# Altium schematic sheet Sheet1.SchDoc
size A4
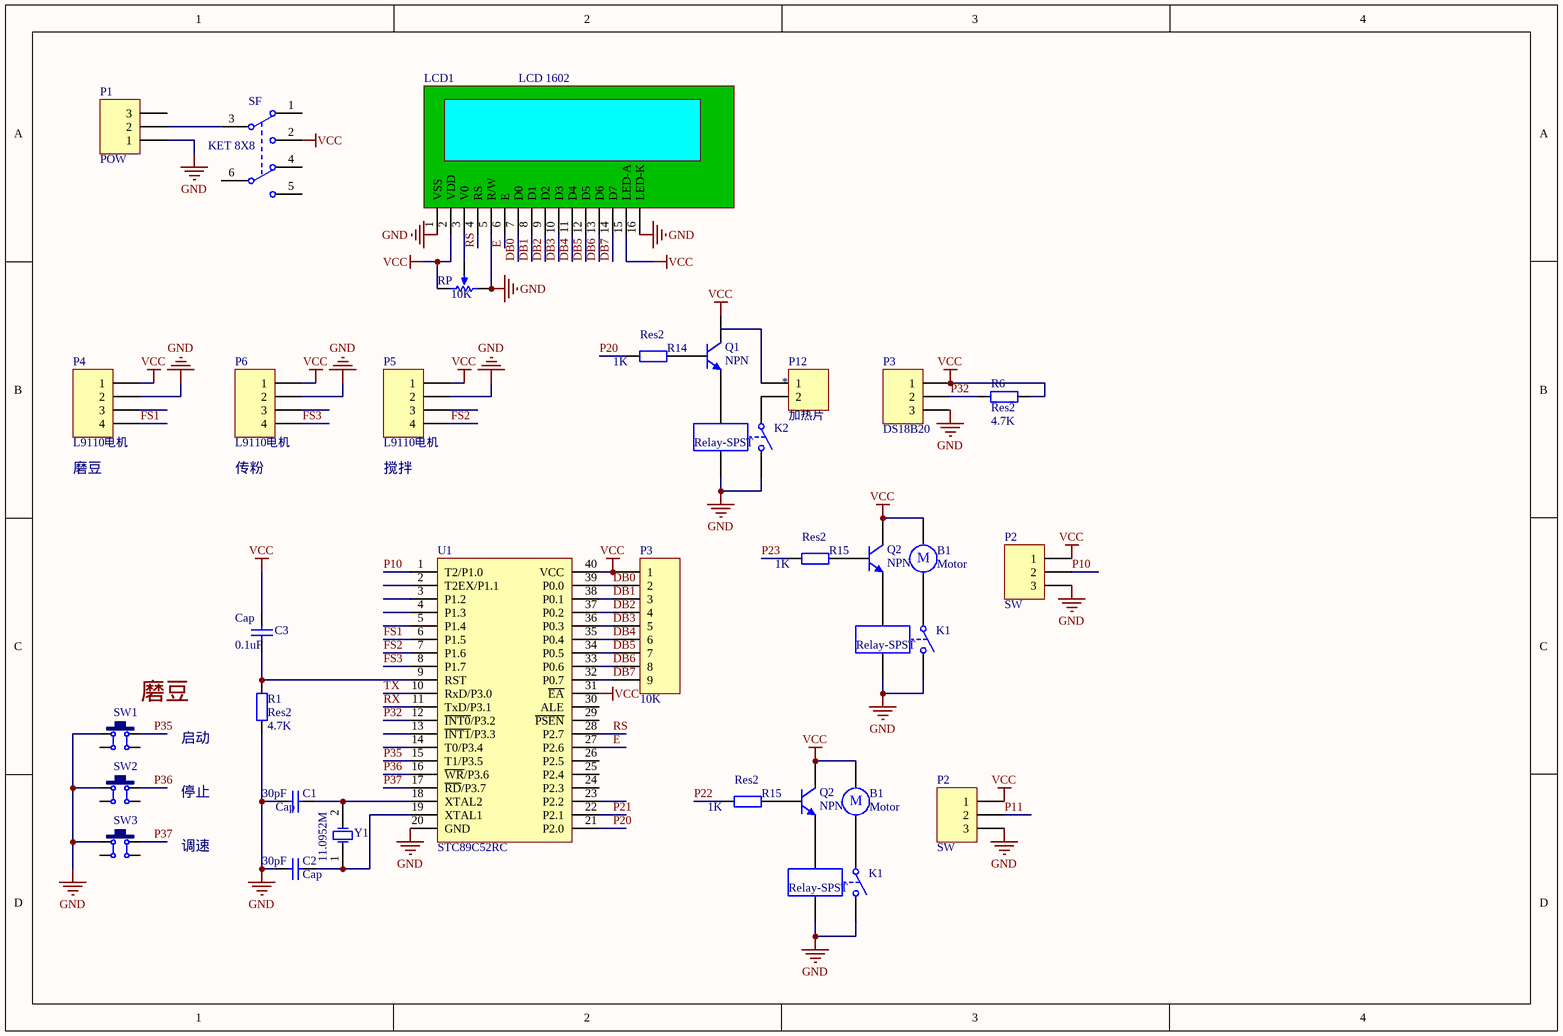
[diagram p0: Sheet1.SchDoc]

## Parts
(Parts that share a designator on the sheet are numbered #1, #2 ... from top to bottom, then left to right.)
B1#1  Motor  [RB5-10.5]
B1#2  Motor  [RB5-10.5]
C1  Cap  value 30pF  [BAT-2]
C2  Cap  value 30pF  [BAT-2]
C3  Cap  value 0.1uF  [RAD-0.1]
K1#1  Relay-SPST  [MODULE4]
K1#2  Relay-SPST  [MODULE4]
K2  Relay-SPST  [MODULE4]
LCD1  LCD 1602  [LCD-1602]
P1  POW  [POW]
P2#1  SW  [DS18B20]
P2#2  SW  [DS18B20]
P3#1  DS18B20  [DS18B20]
P3#2  10K  [HDR1X9]
P4  L9110电机  [HDR1X4]
P5  L9110电机  [HDR1X4]
P6  L9110电机  [HDR1X4]
P12  *  C: 加热片  [HDR1X2]
Q1  NPN  [TO-226-AA]
Q2#1  NPN  [TO-226-AA]
Q2#2  NPN  [TO-226-AA]
R1  Res2  value 4.7K  [AXIAL-0.4]
R6  Res2  value 4.7K  [AXIAL-0.4]
R14  Res2  value 1K  [AXIAL-0.4]
R15#1  Res2  value 1K  [AXIAL-0.4]
R15#2  Res2  value 1K  [AXIAL-0.4]
RP  value 10K  [RP_10K]
SF  KET 8X8  [KFT DIP-8X8]
SW1  6x6x5  [KEY_6*6*6]  (value not drawn)
SW2  6x6x5  [KEY_6*6*6]  (value not drawn)
SW3  6x6x5  [KEY_6*6*6]  (value not drawn)
U1  STC89C52RC  [DIP40-600]
Y1  11.0952M  [AXIAL-0.2]

## Nets
GND: C1.2 C2.1 K1#1.2 K1#1.4 K1#2.2 K1#2.4 K2.2 K2.4 LCD1.1(VSS) LCD1.5(R/W) LCD1.16(LED-K) P1.1 P2#1.3 P2#2.3 P3#1.3 P4.2 P5.2 P6.2 R1.1 RP.1(TOP) SW1.1 SW2.1 SW3.1 U1.20(GND)
VCC: B1#1.1 B1#2.1 C3.1 LCD1.2(VDD) LCD1.15(LED-A) P2#1.1 P2#2.1 P3#1.1 P3#2.1 P4.1 P5.1 P6.1 Q1.1(C) Q2#1.1(C) Q2#2.1(C) R6.2 RP.2(BOT) SF.2(COM2) U1.31(~{EA}) U1.40(VCC)
DB0: LCD1.7(D0) P3#2.2 U1.39(P0.0)
DB1: LCD1.8(D1) P3#2.3 U1.38(P0.1)
DB2: LCD1.9(D2) P3#2.4 U1.37(P0.2)
DB3: LCD1.10(D3) P3#2.5 U1.36(P0.3)
DB4: LCD1.11(D4) P3#2.6 U1.35(P0.4)
DB5: LCD1.12(D5) P3#2.7 U1.34(P0.5)
DB6: LCD1.13(D6) P3#2.8 U1.33(P0.6)
DB7: LCD1.14(D7) P3#2.9 U1.32(P0.7)
E: LCD1.6(E) U1.27(P2.6)
FS1: P4.4 U1.6(P1.5)
FS2: P5.4 U1.7(P1.6)
FS3: P6.4 U1.8(P1.7)
P10: P2#1.2 U1.1(T2/P1.0)
P11: P2#2.2
P20: R14.2 U1.21(P2.0)
P21: U1.22(P2.1)
P22: R15#2.2
P23: R15#1.2
P32: P3#1.2 R6.1 U1.12(~{INT0}/P3.2)
P35: SW1.2 U1.15(T1/P3.5)
P36: SW2.2 U1.16(~{WR}/P3.6)
P37: SW3.2 U1.17(~{RD}/P3.7)
RS: LCD1.4(RS) U1.28(P2.7)
RX: U1.11(TxD/P3.1)
TX: U1.10(RxD/P3.0)
NetB1#1_2: B1#1.2 K1#1.1
NetB1#2_2: B1#2.2 K1#2.1
NetC1_1: C1.1 U1.18(XTAL2) Y1.2(OSC2)
NetC2_2: C2.2 U1.19(XTAL1) Y1.1(OSC1)
NetC3_2: C3.2 R1.2 U1.9(RST)
NetK1#1_3: K1#1.3 Q2#1.3(E)
NetK1#2_3: K1#2.3 Q2#2.3(E)
NetK2_1: K2.1 P12.2
NetK2_3: K2.3 Q1.3(E)
NetLCD1_3: LCD1.3(V0) RP.3(TAP)
NetP1_2: P1.2 SF.3(NO1)
NetQ1_2: Q1.2(B) R14.1
NetQ2#1_2: Q2#1.2(B) R15#1.1
NetQ2#2_2: Q2#2.2(B) R15#2.1

Not connected (* = marked no-connect by the designer): P1 3; P4 3; P5 3; P6 3; P12 1; SF 1(NC1) 4(NO2) 5(COM2) 6(NC2); SW1 3 4; SW2 3 4; SW3 3 4; U1 2(T2EX/P1.1) 3(P1.2) 4(P1.3) 5(P1.4) 13(~{INT1}/P3.3) 14(T0/P3.4) 23(P2.2) 24(P2.3) 25(P2.4) 26(P2.5) 29(~{PSEN}) 30(ALE)

## Notes on the sheet
- (near P4) 磨豆
- (near P6) 传粉
- (near P5) 搅拌
- 启动
- 停止
- 调速
- Labels drawn without touching a wire or pin: 磨豆
- (in symbol Motor) M

## Library data of the parts
B1#1 B1#2 = Motor: Motor, General Kind; Published: 24-Mar-1999; LatestRevisionDate: 17-Jul-2002; LatestRevisionNote: Re-released for DXP Platform.; PackageReference: RB5-10.5; Publisher: Altium Limited; PackageDescription: Capacitor (Radial); 2 Leads
C1-C3 = Cap: Capacitor; Published: 8-Jun-2000; LatestRevisionDate: 17-Jul-2002; LatestRevisionNote: Re-released for DXP Platform.; PackageReference: RAD-0.3; Publisher: Altium Limited; PackageDescription: Radial Cap, Thru-Hole; 2 Leads; 0.3 in Pin Spacing
K1#1 K1#2 K2 = Relay-SPST: Single-Pole Single-Throw Relay; Published: 24-Mar-1999; LatestRevisionDate: 17-Jul-2002; LatestRevisionNote: Re-released for DXP Platform.; PackageReference: MODULE4; Publisher: Altium Limited
LCD1 = LC: BOM名?: LCD 1602; 学?: https://lmdzstyle.taobao.com/
P1 P2#1 P2#2 P3#1 = Header 3: Header, 3-Pin; LatestRevisionDate: 17-Jul-2002; LatestRevisionNote: Re-released for DXP Platform.; Publisher: Altium Limited
P3#2 = Header 9: Header, 9-Pin; LatestRevisionDate: 17-Jul-2002; LatestRevisionNote: Re-released for DXP Platform.; Publisher: Altium Limited
P4-P6 = Header 4: Header, 4-Pin; LatestRevisionDate: 17-Jul-2002; LatestRevisionNote: Re-released for DXP Platform.; Publisher: Altium Limited
P12 = Header 2: Header, 2-Pin; LatestRevisionDate: 17-Jul-2002; LatestRevisionNote: Re-released for DXP Platform.; Publisher: Altium Limited
Q1 Q2#1 Q2#2 = NPN: NPN Bipolar Transistor; Published: 8-Jun-2000; LatestRevisionDate: 17-Jul-2002; LatestRevisionNote: Re-released for DXP Platform.; PackageReference: TO-226-AA; Publisher: Altium Limited; PackageDescription: TO, Flat Index; 3 In-Line, Axial Leads; Body Dia. 4.8mm; Leads 0.55 x 0.51 mm (max); Code_JEDEC: TO-226-AA
R1 R6 R14 R15#1 R15#2 = Res2: Resistor; Published: 8-Jun-2000; LatestRevisionDate: 17-Jul-2002; LatestRevisionNote: Re-released for DXP Platform.; PackageReference: AXIAL-0.4; Publisher: Altium Limited; PackageDescription: Axial Device, Thru-Hole; 2 Leads; 0.4 in Pin Spacing
RP = RPot: Potentiometer; Sim Note: Enter the Resistance value and the set point into parameter fields.; Set Position: 0.5; Published: 8-Jun-2000; LatestRevisionDate: 17-Jul-2002; LatestRevisionNote: Re-released for DXP Platform.; PackageReference: VR5; Publisher: Altium Limited; PackageDescription: Variable Resistor, Thru-Hole; 3 Leads
SF = KET 8X8: 8*8自锁开关; 学?: https://lmdzstyle.taobao.com/
SW1-SW3 = TS: 直插6x6轻触开关; 学?: https://lmdzstyle.taobao.com/
U1 = STC89C52RC: STC单片机; 学?: https://lmdzstyle.taobao.com/
Y1 = XTAL: Crystal Oscillator; Published: 8-Jun-2000; LatestRevisionDate: 17-Jul-2002; LatestRevisionNote: Re-released for DXP Platform.; PackageReference: R38; Publisher: Altium Limited; PackageDescription: Crystal, Thru-Hole; 2 Leads; Body 3.1 x 8.2 mm (Dia.xH)